# Altium schematic sheet 06_BANK_7_8.SchDoc
size OrCAD B
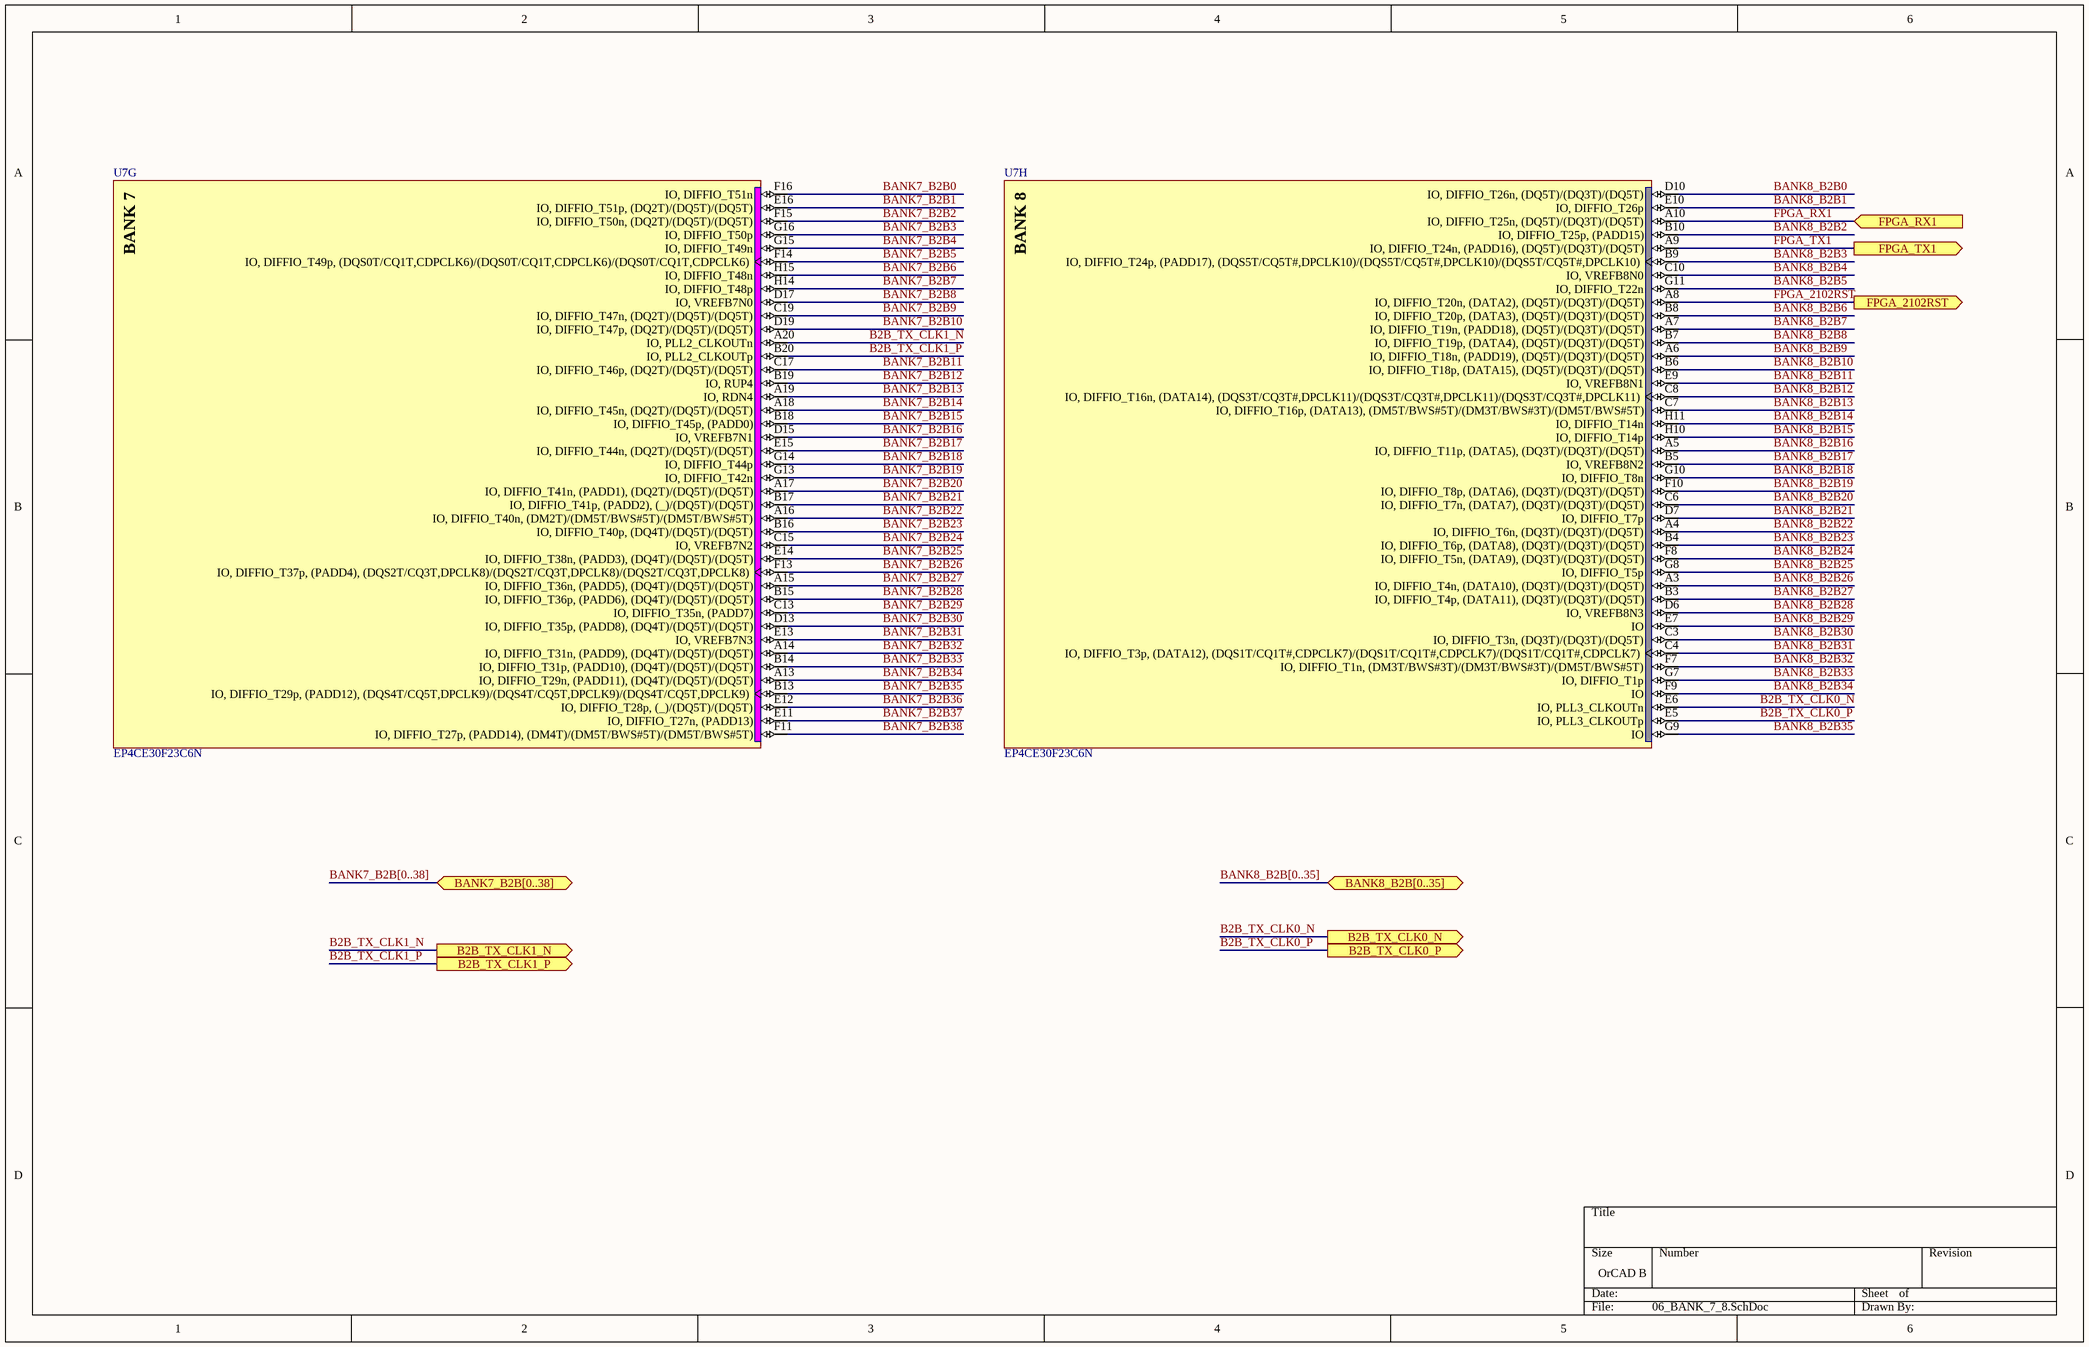
[diagram p0: 06_BANK_7_8.SchDoc]

## Parts
U7  EP4CE30F23C6N  [FBGA484_EP4CE30F23C6N]  (parts G,H of 13)

## Ports
B2B_TX_CLK0_N (out), B2B_TX_CLK0_P (out), B2B_TX_CLK1_N (out), B2B_TX_CLK1_P (out), BANK7_B2B[0..38] (bidir), BANK8_B2B[0..35] (bidir), FPGA_2102RST (out), FPGA_RX1 (in), FPGA_TX1 (out)

## Nets
B2B_TX_CLK0_N: U7.E6(IO,_PLL3_CLKOUTn) ; port B2B_TX_CLK0_N
B2B_TX_CLK0_P: U7.E5(IO,_PLL3_CLKOUTp) ; port B2B_TX_CLK0_P
B2B_TX_CLK1_N: U7.A20(IO,_PLL2_CLKOUTn) ; port B2B_TX_CLK1_N
B2B_TX_CLK1_P: U7.B20(IO,_PLL2_CLKOUTp) ; port B2B_TX_CLK1_P
BANK7_B2B0: U7.F16(IO,_DIFFIO_T51n)
BANK7_B2B1: U7.E16(IO,_DIFFIO_T51p,_(DQ2T)/(DQ5T)/(DQ5T))
BANK7_B2B2: U7.F15(IO,_DIFFIO_T50n,_(DQ2T)/(DQ5T)/(DQ5T))
BANK7_B2B3: U7.G16(IO,_DIFFIO_T50p)
BANK7_B2B4: U7.G15(IO,_DIFFIO_T49n)
BANK7_B2B5: U7.F14(IO,_DIFFIO_T49p,_(DQS0T/CQ1T,CDPCLK6)/(DQS0T/CQ1T,CDPCLK6)/(DQS0T/CQ1T,CDPCLK6))
BANK7_B2B6: U7.H15(IO,_DIFFIO_T48n)
BANK7_B2B7: U7.H14(IO,_DIFFIO_T48p)
BANK7_B2B8: U7.D17(IO,_VREFB7N0)
BANK7_B2B9: U7.C19(IO,_DIFFIO_T47n,_(DQ2T)/(DQ5T)/(DQ5T))
BANK7_B2B10: U7.D19(IO,_DIFFIO_T47p,_(DQ2T)/(DQ5T)/(DQ5T))
BANK7_B2B11: U7.C17(IO,_DIFFIO_T46p,_(DQ2T)/(DQ5T)/(DQ5T))
BANK7_B2B12: U7.B19(IO,_RUP4)
BANK7_B2B13: U7.A19(IO,_RDN4)
BANK7_B2B14: U7.A18(IO,_DIFFIO_T45n,_(DQ2T)/(DQ5T)/(DQ5T))
BANK7_B2B15: U7.B18(IO,_DIFFIO_T45p,_(PADD0))
BANK7_B2B16: U7.D15(IO,_VREFB7N1)
BANK7_B2B17: U7.E15(IO,_DIFFIO_T44n,_(DQ2T)/(DQ5T)/(DQ5T))
BANK7_B2B18: U7.G14(IO,_DIFFIO_T44p)
BANK7_B2B19: U7.G13(IO,_DIFFIO_T42n)
BANK7_B2B20: U7.A17(IO,_DIFFIO_T41n,_(PADD1),_(DQ2T)/(DQ5T)/(DQ5T))
BANK7_B2B21: U7.B17(IO,_DIFFIO_T41p,_(PADD2),_(_)/(DQ5T)/(DQ5T))
BANK7_B2B22: U7.A16(IO,_DIFFIO_T40n,_(DM2T)/(DM5T/BWS#5T)/(DM5T/BWS#5T))
BANK7_B2B23: U7.B16(IO,_DIFFIO_T40p,_(DQ4T)/(DQ5T)/(DQ5T))
BANK7_B2B24: U7.C15(IO,_VREFB7N2)
BANK7_B2B25: U7.E14(IO,_DIFFIO_T38n,_(PADD3),_(DQ4T)/(DQ5T)/(DQ5T))
BANK7_B2B26: U7.F13(IO,_DIFFIO_T37p,_(PADD4),_(DQS2T/CQ3T,DPCLK8)/(DQS2T/CQ3T,DPCLK8)/(DQS2T/CQ3T,DPCLK8))
BANK7_B2B27: U7.A15(IO,_DIFFIO_T36n,_(PADD5),_(DQ4T)/(DQ5T)/(DQ5T))
BANK7_B2B28: U7.B15(IO,_DIFFIO_T36p,_(PADD6),_(DQ4T)/(DQ5T)/(DQ5T))
BANK7_B2B29: U7.C13(IO,_DIFFIO_T35n,_(PADD7))
BANK7_B2B30: U7.D13(IO,_DIFFIO_T35p,_(PADD8),_(DQ4T)/(DQ5T)/(DQ5T))
BANK7_B2B31: U7.E13(IO,_VREFB7N3)
BANK7_B2B32: U7.A14(IO,_DIFFIO_T31n,_(PADD9),_(DQ4T)/(DQ5T)/(DQ5T))
BANK7_B2B33: U7.B14(IO,_DIFFIO_T31p,_(PADD10),_(DQ4T)/(DQ5T)/(DQ5T))
BANK7_B2B34: U7.A13(IO,_DIFFIO_T29n,_(PADD11),_(DQ4T)/(DQ5T)/(DQ5T))
BANK7_B2B35: U7.B13(IO,_DIFFIO_T29p,_(PADD12),_(DQS4T/CQ5T,DPCLK9)/(DQS4T/CQ5T,DPCLK9)/(DQS4T/CQ5T,DPCLK9))
BANK7_B2B36: U7.E12(IO,_DIFFIO_T28p,_(_)/(DQ5T)/(DQ5T))
BANK7_B2B37: U7.E11(IO,_DIFFIO_T27n,_(PADD13))
BANK7_B2B38: U7.F11(IO,_DIFFIO_T27p,_(PADD14),_(DM4T)/(DM5T/BWS#5T)/(DM5T/BWS#5T))
BANK8_B2B0: U7.D10(IO,_DIFFIO_T26n,_(DQ5T)/(DQ3T)/(DQ5T))
BANK8_B2B1: U7.E10(IO,_DIFFIO_T26p)
BANK8_B2B2: U7.B10(IO,_DIFFIO_T25p,_(PADD15))
BANK8_B2B3: U7.B9(IO,_DIFFIO_T24p,_(PADD17),_(DQS5T/CQ5T#,DPCLK10)/(DQS5T/CQ5T#,DPCLK10)/(DQS5T/CQ5T#,DPCLK10))
BANK8_B2B4: U7.C10(IO,_VREFB8N0)
BANK8_B2B5: U7.G11(IO,_DIFFIO_T22n)
BANK8_B2B6: U7.B8(IO,_DIFFIO_T20p,_(DATA3),_(DQ5T)/(DQ3T)/(DQ5T))
BANK8_B2B7: U7.A7(IO,_DIFFIO_T19n,_(PADD18),_(DQ5T)/(DQ3T)/(DQ5T))
BANK8_B2B8: U7.B7(IO,_DIFFIO_T19p,_(DATA4),_(DQ5T)/(DQ3T)/(DQ5T))
BANK8_B2B9: U7.A6(IO,_DIFFIO_T18n,_(PADD19),_(DQ5T)/(DQ3T)/(DQ5T))
BANK8_B2B10: U7.B6(IO,_DIFFIO_T18p,_(DATA15),_(DQ5T)/(DQ3T)/(DQ5T))
BANK8_B2B11: U7.E9(IO,_VREFB8N1)
BANK8_B2B12: U7.C8(IO,_DIFFIO_T16n,_(DATA14),_(DQS3T/CQ3T#,DPCLK11)/(DQS3T/CQ3T#,DPCLK11)/(DQS3T/CQ3T#,DPCLK11))
BANK8_B2B13: U7.C7(IO,_DIFFIO_T16p,_(DATA13),_(DM5T/BWS#5T)/(DM3T/BWS#3T)/(DM5T/BWS#5T))
BANK8_B2B14: U7.H11(IO,_DIFFIO_T14n)
BANK8_B2B15: U7.H10(IO,_DIFFIO_T14p)
BANK8_B2B16: U7.A5(IO,_DIFFIO_T11p,_(DATA5),_(DQ3T)/(DQ3T)/(DQ5T))
BANK8_B2B17: U7.B5(IO,_VREFB8N2)
BANK8_B2B18: U7.G10(IO,_DIFFIO_T8n)
BANK8_B2B19: U7.F10(IO,_DIFFIO_T8p,_(DATA6),_(DQ3T)/(DQ3T)/(DQ5T))
BANK8_B2B20: U7.C6(IO,_DIFFIO_T7n,_(DATA7),_(DQ3T)/(DQ3T)/(DQ5T))
BANK8_B2B21: U7.D7(IO,_DIFFIO_T7p)
BANK8_B2B22: U7.A4(IO,_DIFFIO_T6n,_(DQ3T)/(DQ3T)/(DQ5T))
BANK8_B2B23: U7.B4(IO,_DIFFIO_T6p,_(DATA8),_(DQ3T)/(DQ3T)/(DQ5T))
BANK8_B2B24: U7.F8(IO,_DIFFIO_T5n,_(DATA9),_(DQ3T)/(DQ3T)/(DQ5T))
BANK8_B2B25: U7.G8(IO,_DIFFIO_T5p)
BANK8_B2B26: U7.A3(IO,_DIFFIO_T4n,_(DATA10),_(DQ3T)/(DQ3T)/(DQ5T))
BANK8_B2B27: U7.B3(IO,_DIFFIO_T4p,_(DATA11),_(DQ3T)/(DQ3T)/(DQ5T))
BANK8_B2B28: U7.D6(IO,_VREFB8N3)
BANK8_B2B29: U7.E7(IO)
BANK8_B2B30: U7.C3(IO,_DIFFIO_T3n,_(DQ3T)/(DQ3T)/(DQ5T))
BANK8_B2B31: U7.C4(IO,_DIFFIO_T3p,_(DATA12),_(DQS1T/CQ1T#,CDPCLK7)/(DQS1T/CQ1T#,CDPCLK7)/(DQS1T/CQ1T#,CDPCLK7))
BANK8_B2B32: U7.F7(IO,_DIFFIO_T1n,_(DM3T/BWS#3T)/(DM3T/BWS#3T)/(DM5T/BWS#5T))
BANK8_B2B33: U7.G7(IO,_DIFFIO_T1p)
BANK8_B2B34: U7.F9(IO)
BANK8_B2B35: U7.G9(IO)
FPGA_2102RST: U7.A8(IO,_DIFFIO_T20n,_(DATA2),_(DQ5T)/(DQ3T)/(DQ5T)) ; port FPGA_2102RST
FPGA_RX1: U7.A10(IO,_DIFFIO_T25n,_(DQ5T)/(DQ3T)/(DQ5T)) ; port FPGA_RX1
FPGA_TX1: U7.A9(IO,_DIFFIO_T24n,_(PADD16),_(DQ5T)/(DQ3T)/(DQ5T)) ; port FPGA_TX1

## Buses and harness runs
bus BANK7_B2B[0..38] = port BANK7_B2B[0..38]
bus BANK8_B2B[0..35] = port BANK8_B2B[0..35]

## Notes on the sheet
- (in symbol EP4CE30F23C6N, part G) BANK 7
- (in symbol EP4CE30F23C6N, part H) BANK 8

## Library data of the parts
U7 = EP4CE30F23C6N: IC,FPGA,28848 LEs,Speed-6,FBGA484; Manufacturer1: ALTERA; PartNumberManufacturer1: EP4CE30F23C6N; UnitPrice: *; PartNumberManufacturer2: *; Manufacturer2: *